# EasyEDA schematic GeneralPortBreakout.json
TITLE: General Purpose External Connector Breakout; REV: 1.0; Date: 30-11-2023; Sheet: 1/1; Drawn By: Shane Wood
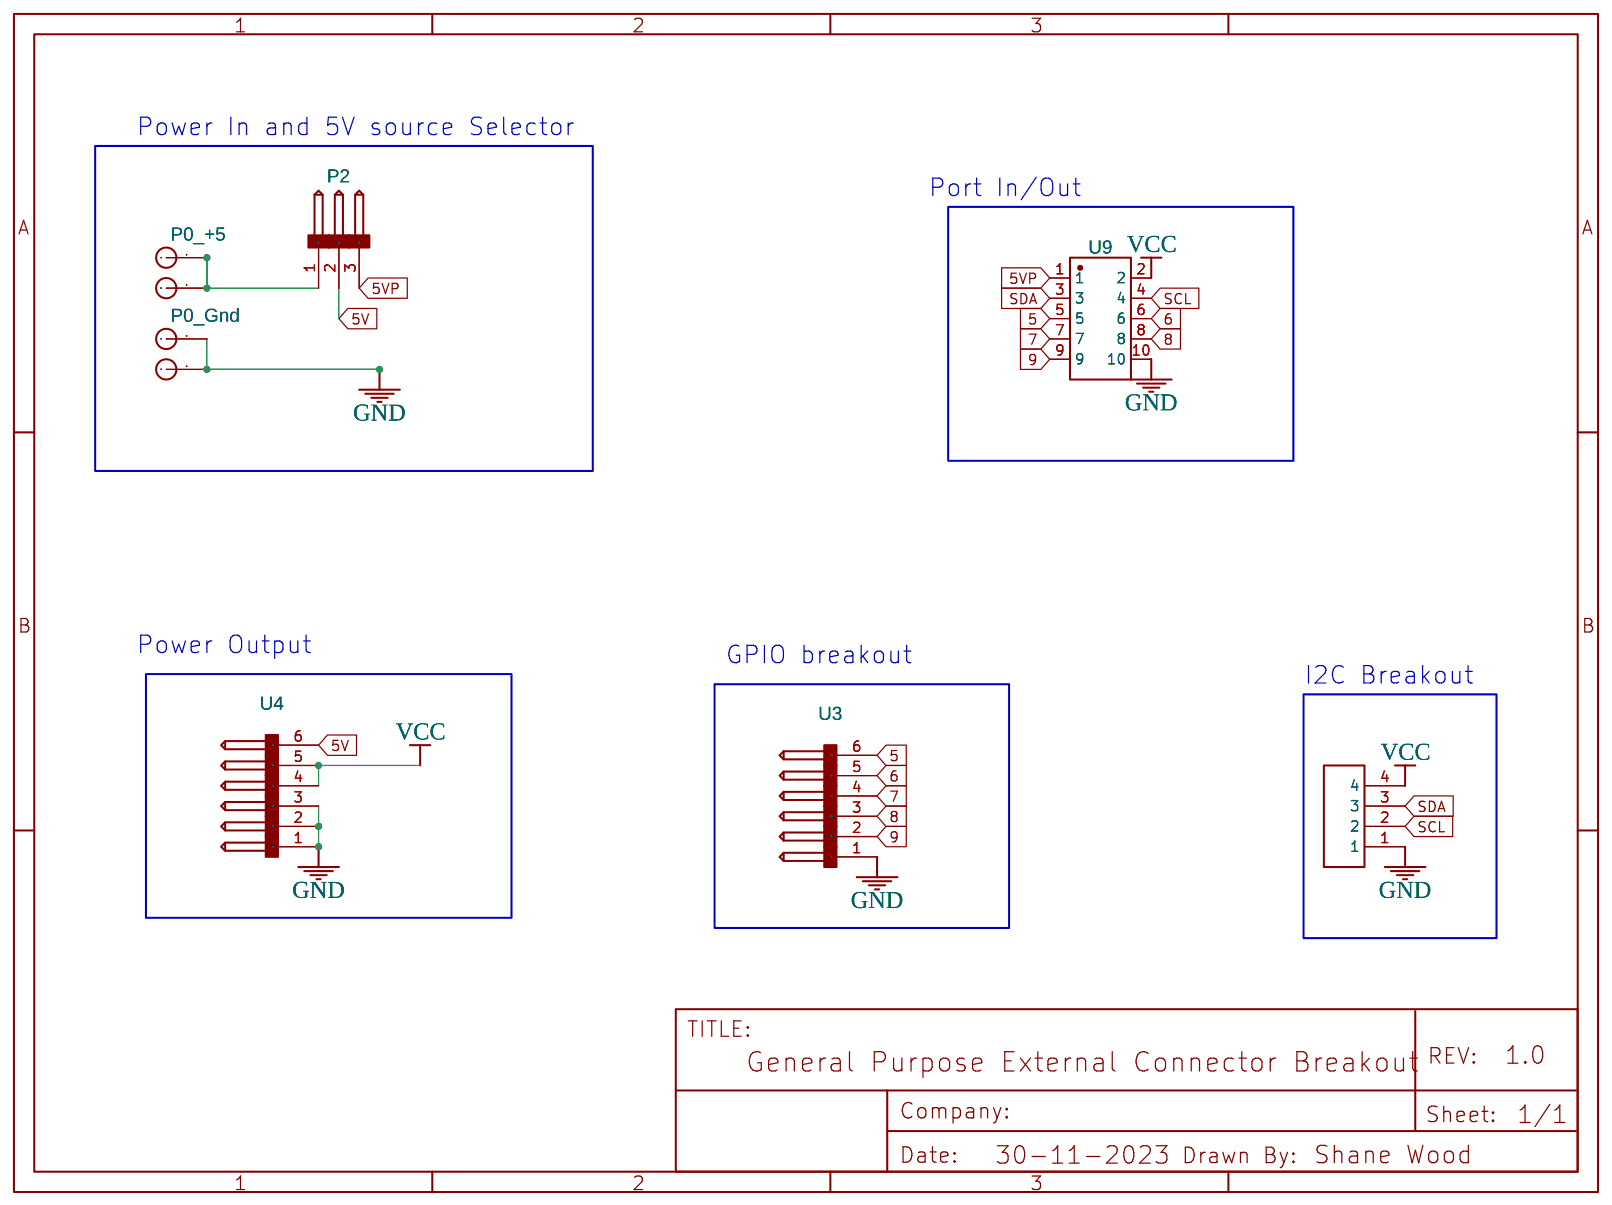
[diagram p0: schematic sheet]

## Parts
P1  Connector_1x4/2.5mm  [HDR-1X4/2.54]
P2  HDR-PIN-MALE-2.54-1x3  [PKG-HDR-1X3-2.54]
U1  NO  [14AWG PTH LARGE]
U2  P0_+5  [14AWG PTH LARGE]
U3  NO  [PKG-HDR-1X6-2.54]
U4  NO  [PKG-HDR-1X6-2.54]
U5  NO  [14AWG PTH LARGE]
U6  P0_Gnd  [14AWG PTH LARGE]
U9  NO  [CONN-TH_10P-P2.54_KINGHELM_KH-2.54PH180-2X5P-L8.9]

## Library data of the parts
P1 = Connector_1x4/2.5mm: Contributor: David Lochlin
P2 = HDR-PIN-MALE-2.54-1x3
U1 U2 U5 U6 = Wire Hole 14AWG: Manufacturer Part: Wire Hole; Contributor: dropTarget
U3 U4 = HDR-PIN-MALE-2.54-1x6
U9 = KH-2.54PH180-2X5P: Supplier: LCSC; Supplier Part: C5157628; Manufacturer: kinghelm(金航标); Manufacturer Part: KH-2.54PH180-2X5P-L8.9; link: https://atta.szlcsc.com/upload/public/pdf/source/20220906/04BEB622ED10B556BB25C8F90E10FD05.pdf; Contributor: lcsc; JLCPCB Part Class: Extended Part

## Nets
5V: P2.2 U4.6
5VP: P2.3 U9.1
GND: P1.1 U3.1 U4.1 U4.2 U4.3 U5.1 U6.1 U9.10
VCC: P1.4 U4.4 U4.5 U9.2
5: U3.6 U9.5
6: U3.5 U9.6
7: U3.4 U9.7
8: U3.3 U9.8
9: U3.2 U9.9
SCL: P1.2 U9.4
SDA: P1.3 U9.3
Net-(P2-1): P2.1 U1.1 U2.1

## Notes on the sheet
- Power In and 5V source Selector
- Port In/Out
- Power Output
- GPIO breakout
- I2C Breakout
